# EAGLE schematic Syn-SDCard-minimal-v00 (EAGLE 5.11)
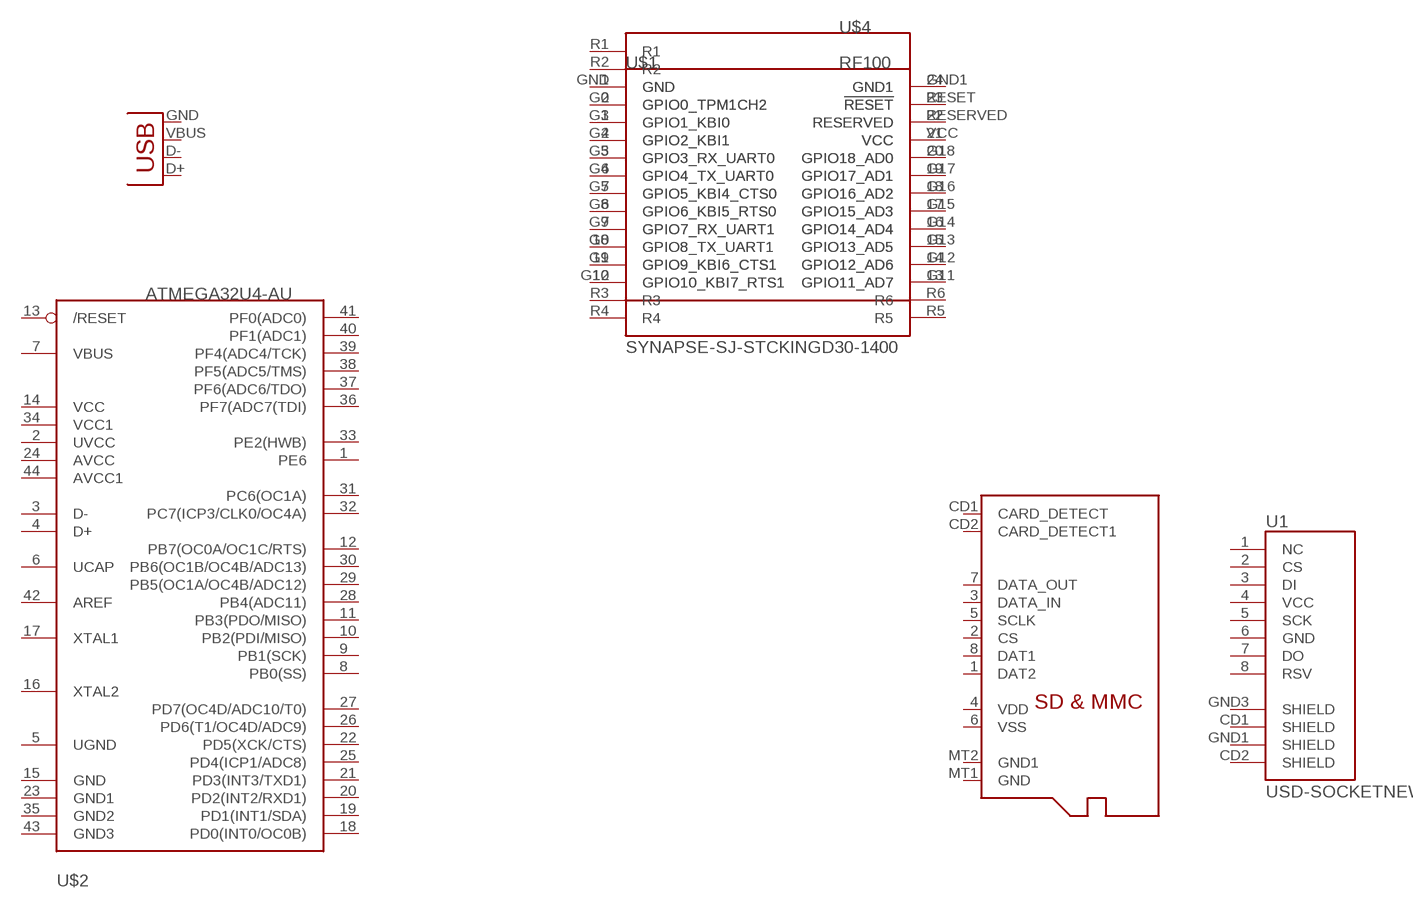
[diagram p0: schematic, sheet 1]

## Parts
U1  USD-SOCKETNEW  [MICRO-SD-SOCKET-PP]
U$1  SYNAPSEWIRELESS-RFENGINESTDTHM  [SYNAPSERFENGINE-THM]
U$2  ATMEGA32U4-AU  [TQFP44]
U$3  MICROSD  [MICROSD]
U$4  SYNAPSE-SJ-STCKINGD30-1400  [SYNSJ-STACK-SMALLER]
X1  USBSMD  [USB-MINIB]

## Nets
N$1: U$1.1(GND) U$4.GND
N$2: U$1.2(GPIO0_TPM1CH2) U$4.G0(GPIO0_TPM1CH2)
N$3: U$1.3(GPIO1_KBI0) U$4.G1(GPIO1_KBI0)
N$4: U$1.4(GPIO2_KBI1) U$4.G2(GPIO2_KBI1)
N$5: U$1.5(GPIO3_RX_UART0) U$4.G3(GPIO3_RX_UART0)
N$6: U$1.6(GPIO4_TX_UART0) U$4.G4(GPIO4_TX_UART0)
N$7: U$1.7(GPIO5_KBI4_CTS0) U$4.G5(GPIO5_KBI4_CTS0)
N$8: U$1.8(GPIO6_KBI5_RTS0) U$4.G6(GPIO6_KBI5_RTS0)
N$9: U$1.9(GPIO7_RX_UART1) U$4.G7(GPIO7_RX_UART1)
N$10: U$1.10(GPIO8_TX_UART1) U$4.G8(GPIO8_TX_UART1)
N$11: U$1.11(GPIO9_KBI6_CTS1) U$4.G9(GPIO9_KBI6_CTS1)
N$12: U$1.12(GPIO10_KBI7_RTS1) U$4.G10(GPIO10_KBI7_RTS1)
N$13: U$1.24(GND1) U$4.GND1
N$14: U$1.23(!RESET) U$4.RESET(!RESET)
N$15: U$1.22(RESERVED) U$4.RESERVED
N$16: U$1.21(VCC) U$4.VCC
N$17: U$1.20(GPIO18_AD0) U$4.G18(GPIO18_AD0)
N$18: U$1.19(GPIO17_AD1) U$4.G17(GPIO17_AD1)
N$19: U$1.18(GPIO16_AD2) U$4.G16(GPIO16_AD2)
N$20: U$1.17(GPIO15_AD3) U$4.G15(GPIO15_AD3)
N$21: U$1.16(GPIO14_AD4) U$4.G14(GPIO14_AD4)
N$22: U$1.15(GPIO13_AD5) U$4.G13(GPIO13_AD5)
N$23: U$1.14(GPIO12_AD6) U$4.G12(GPIO12_AD6)
N$24: U$1.13(GPIO11_AD7) U$4.G11(GPIO11_AD7)
Unconnected: U1.1(NC) U1.2(CS) U1.3(DI) U1.4(VCC) U1.5(SCK) U1.6(GND) U1.7(DO) U1.8(RSV) U1.CD1(SHIELD) U1.CD2(SHIELD) U1.GND1(SHIELD) U1.GND3(SHIELD) U$2.1(PE6) U$2.2(UVCC) U$2.3(D-) U$2.4(D+) U$2.5(UGND) U$2.6(UCAP) U$2.7(VBUS) U$2.8(PB0(SS)) U$2.9(PB1(SCK)) U$2.10(PB2(PDI/MISO)) U$2.11(PB3(PDO/MISO)) U$2.12(PB7(OC0A/OC1C/RTS)) U$2.13(/RESET) U$2.14(VCC) U$2.15(GND) U$2.16(XTAL2) U$2.17(XTAL1) U$2.18(PD0(INT0/OC0B)) U$2.19(PD1(INT1/SDA)) U$2.20(PD2(INT2/RXD1)) U$2.21(PD3(INT3/TXD1)) U$2.22(PD5(XCK/CTS)) U$2.23(GND1) U$2.24(AVCC) U$2.25(PD4(ICP1/ADC8)) U$2.26(PD6(T1/OC4D/ADC9)) U$2.27(PD7(OC4D/ADC10/T0)) U$2.28(PB4(ADC11)) U$2.29(PB5(OC1A/OC4B/ADC12)) U$2.30(PB6(OC1B/OC4B/ADC13)) U$2.31(PC6(OC1A)) U$2.32(PC7(ICP3/CLK0/OC4A)) U$2.33(PE2(HWB)) U$2.34(VCC1) U$2.35(GND2) U$2.36(PF7(ADC7(TDI)) U$2.37(PF6(ADC6/TDO)) U$2.38(PF5(ADC5/TMS)) U$2.39(PF4(ADC4/TCK)) U$2.40(PF1(ADC1)) U$2.41(PF0(ADC0)) U$2.42(AREF) U$2.43(GND3) U$2.44(AVCC1) U$3.1(DAT2) U$3.2(CS) U$3.3(DATA_IN) U$3.4(VDD) U$3.5(SCLK) U$3.6(VSS) U$3.7(DATA_OUT) U$3.8(DAT1) U$3.CD1(CARD_DETECT) U$3.CD2(CARD_DETECT1) U$3.MT1(GND) U$3.MT2(GND1) U$4.R1 U$4.R2 U$4.R3 U$4.R4 U$4.R5 U$4.R6 X1.D+ X1.D- X1.GND X1.VBUS

## Library data of the parts
U1 = SparkFun:USD-SOCKET: microSD Socket Push-push type uSD socket. Schematic element and footprint production proven. Spark Fun Electronics SKU : PRT-00127. tDoc lines correctly indicate media card edge positions when inserting (unlocked, locked, depressed).
U$1 = 0_jc-custom:SYNAPSEWIRELESS-RFENGINE
U$2 = adafruit:ATMEGA32U4: http://www.ladyada.net/library/eagle
U$3 = adafruit:MICROSD: Micro-SD / Transflash card holder with SPI pinout For the 3M # 2908-05WB-MG and/or 4UCON #19656 push-push type
U$4 = 0_jc-custom:SYNAPSE-SJ-STCKING: Standard layout for expansion modules using Synapse Wireless boards
X1 = 0_jc-custom:USB: USB Connectors USB-B-PTH is fully proven SKU : PRT-00139 USB-miniB is fully proven SKU : PRT-00587 USB-A-PCB is untested. USB-A-H is throughly reviewed, but untested. Spark Fun Electronics SKU : PRT-00437 USB-B-SMT is throughly reviewed, but untested. Needs silkscreen touching up. USB-A-S has not been used/tested USB-MB-H has not been used/tested